# Altium schematic sheet I2C_Modules.SchDoc
size A4; SheetNumber: 12; SheetTotal: 13
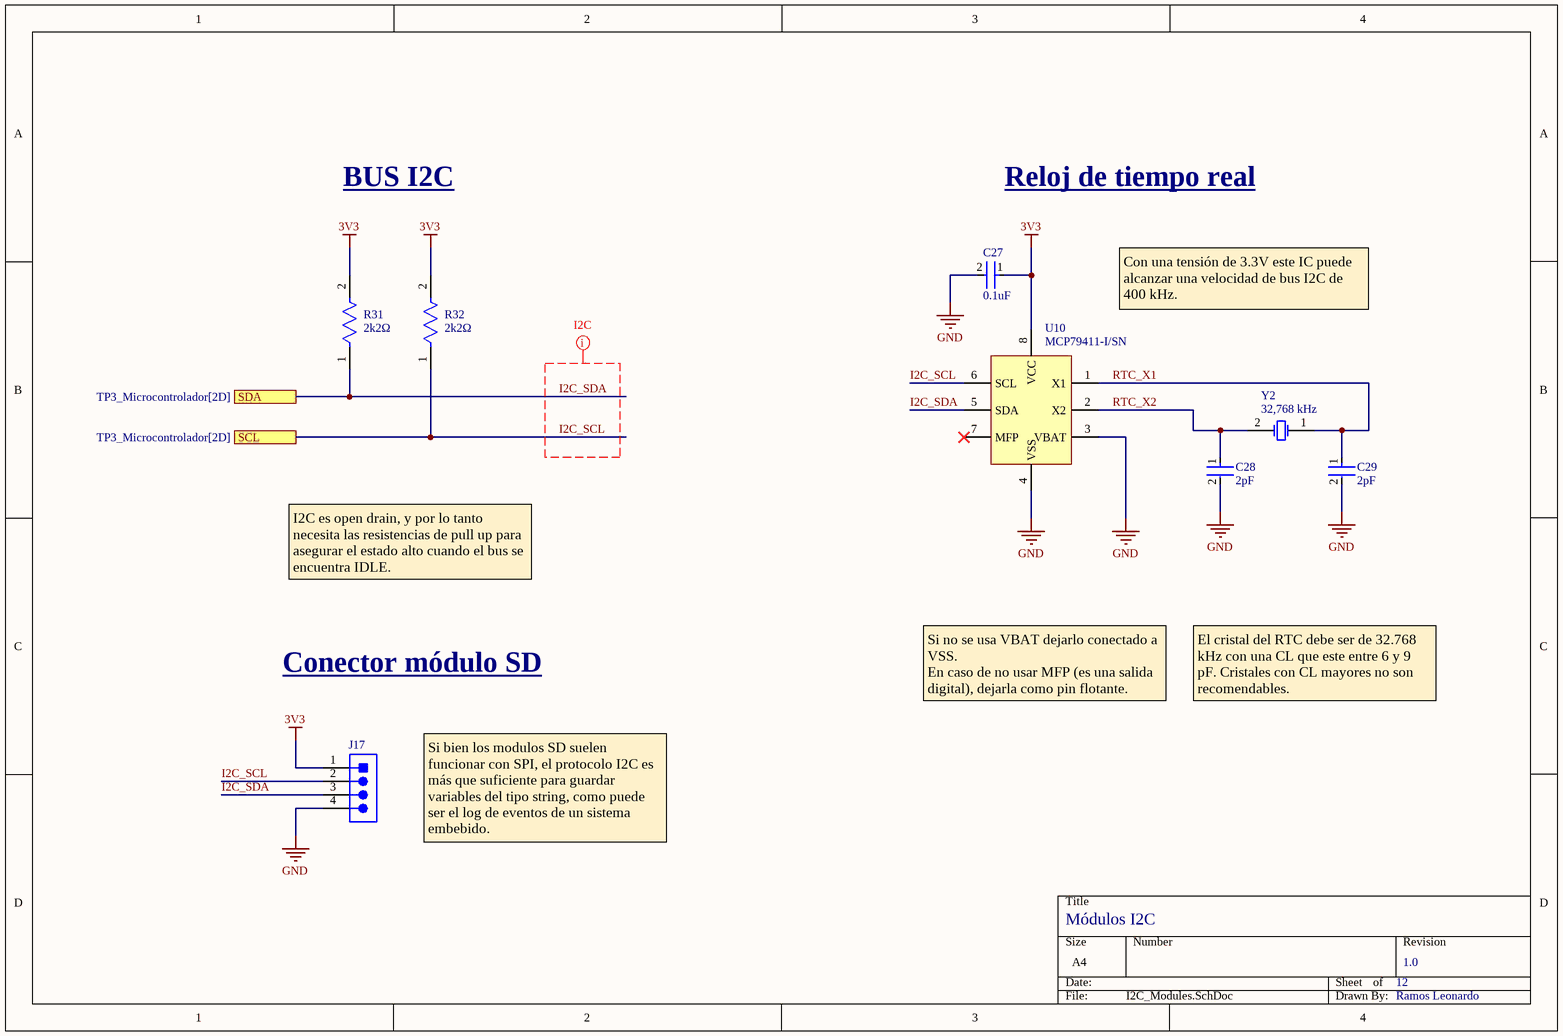
[diagram p0: I2C_Modules.SchDoc]

## Parts
C27  value 0.1uF  [FP-CC0805-0_85-MFG]  (hidden comment: CC0805KRX7R8BB104)
C28  value 2pF  [FP-CC0805-0_85-MFG]  (hidden comment: CC0805KRX7R8BB104)
C29  value 2pF  [FP-CC0805-0_85-MFG]  (hidden comment: CC0805KRX7R8BB104)
J17  22-27-2041  [MOLX-22-27-2041_V]  (value not drawn)
R31  Resistance: 2k2Ω  [FP-CRCW0805-e3-IPC_B]  (hidden comment: CRCW08054K70JNEA)
R32  Resistance: 2k2Ω  [FP-CRCW0805-e3-IPC_B]  (hidden comment: CRCW08054K70JNEA)
U10  MCP79411-I/SN  [SOIC8-RTC]
Y2  32,768 kHz  [WE-XTAL_CFPX-217]

## Ports
SCL (see TP3_Microcontrolador[2D]), SDA (see TP3_Microcontrolador[2D])

## Nets
3V3: C27.1 J17.1 R31.2 R32.2 U10.8(VCC)
GND: C27.2 C28.2 C29.2 J17.4 U10.3(VBAT) U10.4(VSS)
I2C_SCL: J17.2 R32.1 U10.6(SCL) ; port SCL
I2C_SDA: J17.3 R31.1 U10.5(SDA) ; port SDA
RTC_X1: C29.1 U10.1(X1) Y2.1(OSC1)
RTC_X2: C28.1 U10.2(X2) Y2.2(OSC2)

Not connected (* = marked no-connect by the designer): U10 7(MFP)*

## Layout directives
net class I2C: I2C_SCL, I2C_SDA

## Notes on the sheet
- BUS I2C
- Reloj de tiempo real
- Con una tensión de 3.3V este IC puede alcanzar una velocidad de bus I2C de 400 kHz.
- I2C es open drain, y por lo tanto necesita las resistencias de pull up para asegurar el estado alto cuando el bus se encuentra IDLE.
- Conector módulo SD
- Si no se usa VBAT dejarlo conectado a VSS.
  En caso de no usar MFP (es una salida digital), dejarla como pin flotante.
- El cristal del RTC debe ser de 32.768 kHz con una CL que este entre 6 y 9 pF. Cristales con CL mayores no son recomendables.
- Si bien los modulos SD suelen funcionar con SPI, el protocolo I2C es más que suficiente para guardar variables del tipo string, como puede ser el log de eventos de un sistema embebido.
- Módulos I2C
- 12
- 1.0
- Ramos Leonardo

## Library data of the parts
C27 = CMP-1036-04410-2: CAP CER 0.1UF 25V X7R 0805; Manufacturer: Yageo; Tolerance: 0.1; Material: Ceramic; Capacitance: 100 nF; ComponentLink2URL: http://www.yageo.com/documents/recent/UPY-GPHC_Y5V_6.3V-to-50V_8.pdf; Category: Cap; Mouser Description: Multilayer Ceramic Capacitors MLCC - SMD/SMT 100nF 25V X7R 10%; Manufacturer Part Number: CC0805KRX7R8BB104; Device Class L1: Passive Components; Footprint Url: http://www.yageo.com/exep/pages/download/literatures/UPY-C_GEN_24.pdf; Height: 0.95mm; Digikey Description: CAP CER 0.1UF 25V X7R 0805; Lead Free: Yes; Temperature Range High: +85°C; Temperature: -30°C to +85°C; Ipc Land Pattern Name: CAPC200125X85; Automotive: No; Octopart: https://octopart.com/cc0805krx7r8bb104-yageo-39467766; Device Class L2: Capacitors; Temperature Characteristic: X7R; Voltage Rating: 25 V; ComponentLink2Description: Datasheet; Temperature Range Low: -30°C; Device Class L3: Ceramic Capacitors; RoHS: TRUE; Package: CC0805-0.85
C28 C29 = CMP-1036-04410-2: CAP CER 2pF 25V X7R 0805; Manufacturer: Yageo; Tolerance: 0.1; Material: Ceramic; ComponentLink2URL: http://www.yageo.com/documents/recent/UPY-GPHC_Y5V_6.3V-to-50V_8.pdf; Category: Cap; Mouser Description: Multilayer Ceramic Capacitors MLCC - SMD/SMT 100nF 25V X7R 10%; Manufacturer Part Number: CC0805KRX7R8BB104; Device Class L1: Passive Components; Footprint Url: http://www.yageo.com/exep/pages/download/literatures/UPY-C_GEN_24.pdf; Height: 0.95mm; Digikey Description: CAP CER 0.1UF 25V X7R 0805; Lead Free: Yes; Temperature Range High: +85°C; Temperature: -30°C to +85°C; Ipc Land Pattern Name: CAPC200125X85; Capacitance: 2pF; Automotive: No; Octopart: https://octopart.com/cc0805krx7r8bb104-yageo-39467766; Device Class L2: Capacitors; Temperature Characteristic: X7R; Voltage Rating: 25 V; ComponentLink2Description: Datasheet; Temperature Range Low: -30°C; Device Class L3: Ceramic Capacitors; RoHS: TRUE; Package: CC0805-0.85
J17 = CMP-2000-05243-1: Male Header, Pitch 2.54 mm, 1 x 4 Position, Height 11.7 mm, Tail Length 3.56 mm, RoHS, Bulk; Manufacturer: Molex; Voltage rating: 250V; Current rating: 4A; Datasheet Version: Rev. F, 06/2009; Operating temperature: 0degCto+75degC; Contact material: Tinplatedbrass; Manufacturer URL: http://www.molex.com/; Housing material: Nylon(UL94V-0); Datasheet URL: http://www.molex.com/pdm_docs/sd/022272041_sd.pdf
R31 R32 = CMP-2001-03967-2: RES Thick Film, 5%, 0.125W, 200ppm/°C, 0805; Power Rating: 125mW; Voltage Rating: 150V; Radiation Hardening: No; Case Code (Imperial): 0805; Military Standard: Not; Contact Plating: Tin; Weight: 0.000194oz; Mount: Surface Mount; Termination: SMD/SMT; Packaging: Tape and Reel; Min Operating Temperature: -55°C; Width: 1.25mm; Tolerance: 5%; Height: 0.45mm; Depth: 1.25mm; Length: 2mm; Temperature Coefficient: 200ppm/°C; Case Code (Metric): 2012; Package Quantity: 5000; Max Operating Temperature: 155°C; Case/Package: 0805; Composition: Thick Film
U10 = MCP79411-I/SN: Real time clock from Microchip
Y2 = CMP-03913-116876464-1: 830054236 WE-XTAL Quartz Crystal; Frequency: 32.768kHz; Min Operating Temperature: -40°C; Max Operating Temperature: 85°C; NexarPartId: 116876464; Height: 900µm; Length: 3.2mm; Width: 1.5mm